# EAGLE design mother_card_cs_524pm (EAGLE 8.3.2)
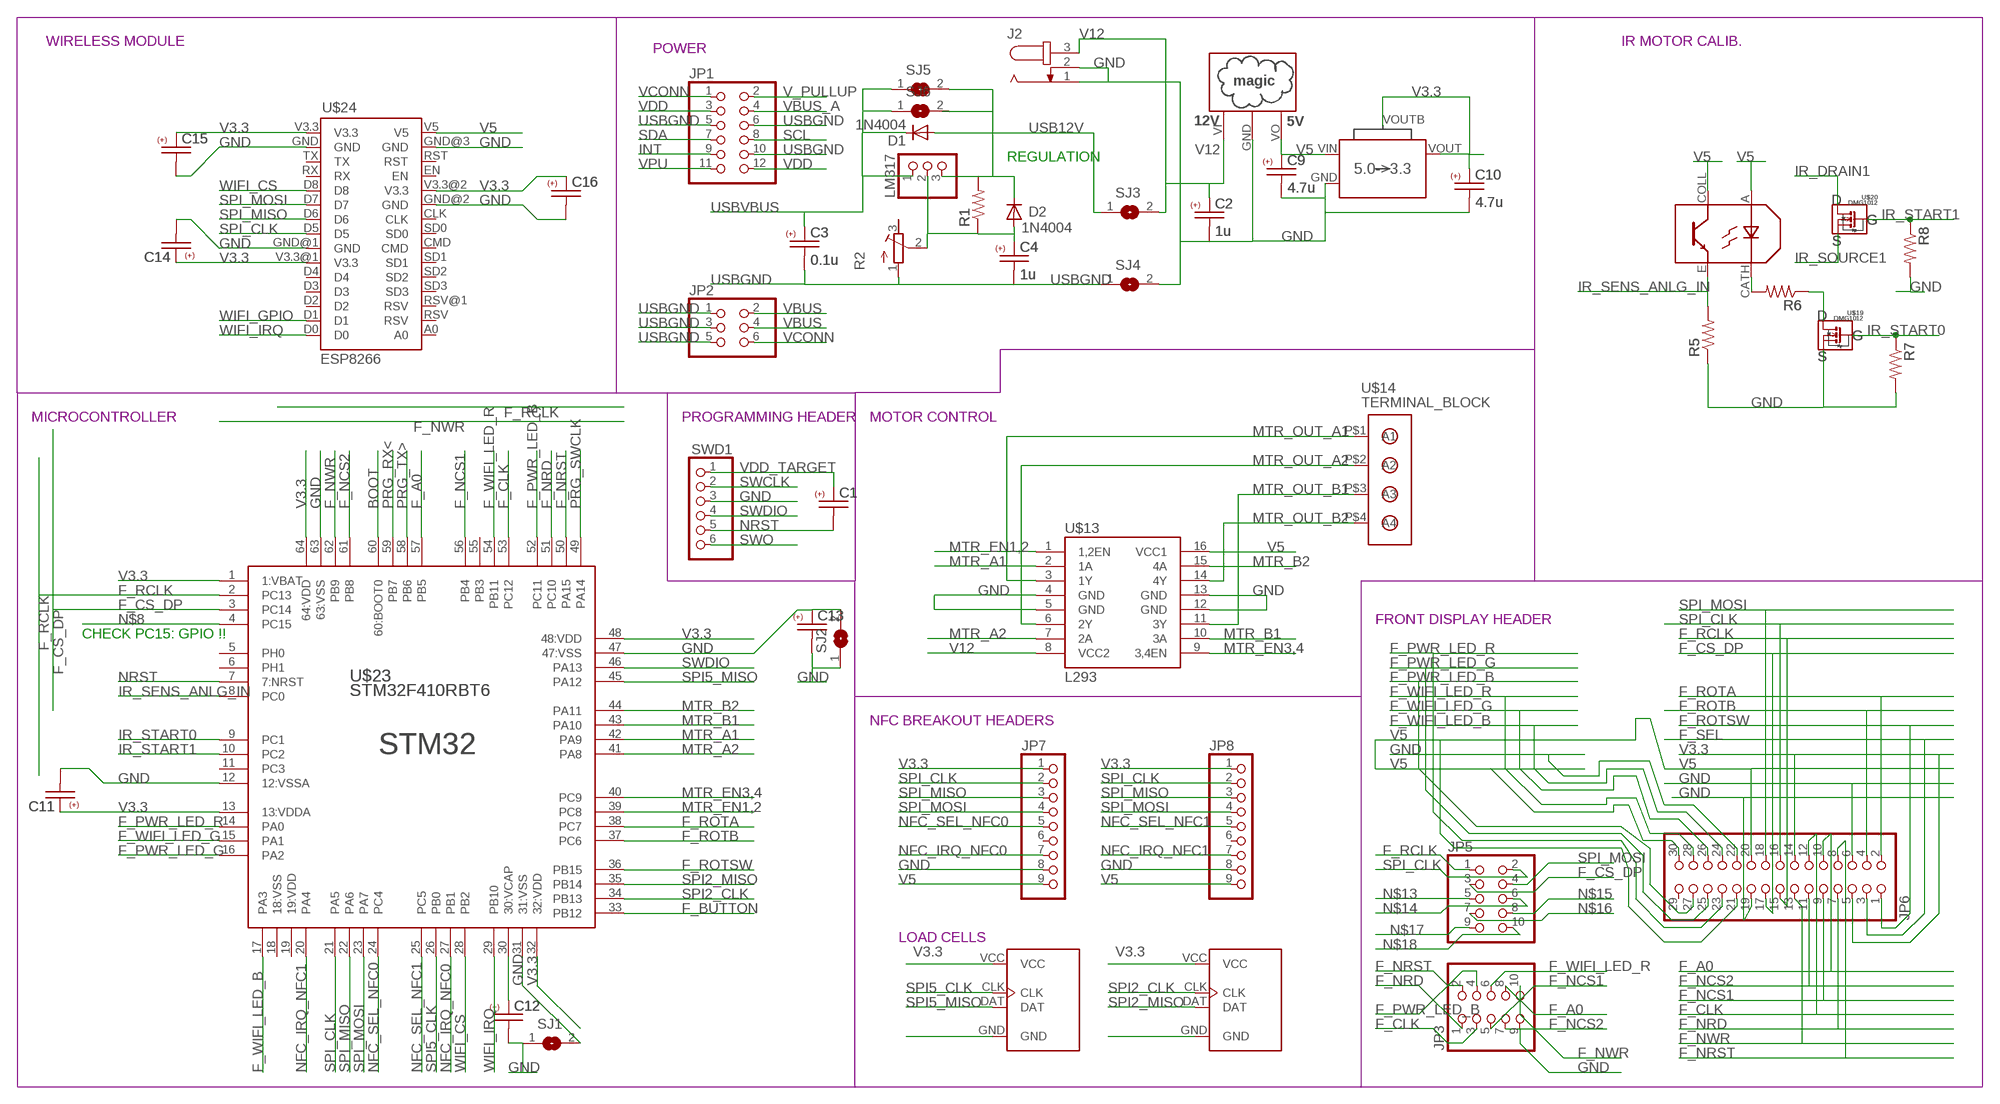
[diagram p0: schematic, sheet 1]

## Parts
C1  C-USC0805  [C0805]
C2  1u  C-USC0805  [C0805]
C3  0.1u  C-USC0805  [C0805]
C4  1u  C-USC0805  [C0805]
C9  4.7u  C-USC0805  [C0805]
C10  4.7u  C-USC0805  [C0805]
C11  C-USC0805  [C0805]
C12  C-USC0805  [C0805]
C13  C-USC0805  [C0805]
C14  C-USC0805  [C0805]
C15  C-USC0805  [C0805]
C16  C-USC0805  [C0805]
D1  1N4004  [DO41-10]
D2  1N4004  [DO41-10]
J2  JACK-PLUG0  [SPC4077]
JP1  PINHD-2X6  [2X06]
JP2  PINHD-2X3  [2X03]
JP3  PINHD-2X5  [2X05]
JP5  PINHD-2X5  [2X05]
JP6  PINHD-2X15/SOCK  [2X15/SOCK]
JP7  PINHD-1X9/90  [1X09/90]
JP8  PINHD-1X9/90  [1X09/90]
LM317  PINHD-1X3  [1X03]
R1  R-US_R0805  [R0805]
R2  R-TRIMM64W  [RTRIM64W]
R5  R-US_R0805  [R0805]
R6  R-US_R0805  [R0805]
R7  R-US_R0805  [R0805]
R8  R-US_R0805  [R0805]
SJ1  SJ  [SJ]
SJ2  SJ  [SJ]
SJ3  SJ  [SJ]
SJ4  SJ  [SJ]
SJ5  SJ  [SJ]
SJ6  SJ  [SJ]
SWD1  PINHD-1X6  [1X06]
U$13  L293  [DIL16]
U$14  TERMINAL_BLOCK  [1X4/BLOCK]
U$15  AP2114H  [AP2114H]
U$16  OKI-78SR-W36  [SIP3]
U$18  TCRT5000  [TCRT5000]
U$19  DMG1012  [SOT323]
U$20  DMG1012  [SOT323]
U$21  HX711  [HX711]
U$22  HX711  [HX711]
U$23  STM32F410RBT6  [QFP50P1200X1200X160-64N]
U$24  ESP8266  [ESP8266]

## Nets
BOOT: U$23.60(60:BOOT0)
F_A0: JP3.8 JP6.10 U$23.57(PB5)
F_BUTTON: U$23.33(PB12)
F_CLK: JP3.3 JP6.12 U$23.53(PC12)
F_CS_DP: JP5.3 JP6.17 U$23.3(PC14)
F_NCS1: JP3.5 JP6.9 U$23.56(PB4)
F_NCS2: JP3.7 JP6.11 U$23.61(PB8)
F_NRD: JP3.1 JP6.7 U$23.51(PC10)
F_NRST: JP3.2 JP6.8 U$23.50(PA15)
F_NWR: JP3.10 JP6.13 U$23.62(PB9)
F_PWR_LED_B: JP3.4 JP6.27 U$23.52(PC11)
F_PWR_LED_G: JP6.25 U$23.16(PA2)
F_PWR_LED_R: JP6.23 U$23.14(PA0)
F_RCLK: JP5.1 JP6.15 U$23.2(PC13)
F_ROTA: JP6.2 U$23.38(PC7)
F_ROTB: JP6.4 U$23.37(PC6)
F_ROTSW: JP6.1 U$23.36(PB15)
F_SEL: JP6.3
F_WIFI_LED_B: JP6.24 U$23.17(PA3)
F_WIFI_LED_G: JP6.26 U$23.15(PA1)
F_WIFI_LED_R: JP3.6 JP6.28 U$23.54(PB11)
GND: C2.2 C9.2 C10.2 C11.2 C12.2 C13.1 C14.2 C15.2 C16.2 J2.1 J2.2 JP3.9 JP6.6 JP6.19 JP6.22 JP7.8 JP8.8 R5.1 R7.2 R8.2 SJ1.1 SJ1.2 SJ2.2 SJ4.2 SWD1.3 U$13.4(GND) U$13.5(GND) U$13.12(GND) U$13.13(GND) U$15.GND U$16.GND U$19.S U$21.GND U$22.GND U$23.12(12:VSSA) U$23.31(31:VSS) U$23.47(47:VSS) U$23.63(63:VSS) U$24.GND U$24.GND@1(GND) U$24.GND@2(GND) U$24.GND@3(GND)
INT: JP1.9
IR_DRAIN1: U$20.D
IR_SENS_ANLG_IN: R5.2 U$18.E U$23.8(PC0)
IR_SOURCE1: U$20.S
IR_START0: R7.1 U$19.G U$23.9(PC1)
IR_START1: R8.1 U$20.G U$23.10(PC2)
MTR_A1: U$13.2(1A) U$23.42(PA9)
MTR_A2: U$13.7(2A) U$23.41(PA8)
MTR_B1: U$13.10(3A) U$23.43(PA10)
MTR_B2: U$13.15(4A) U$23.44(PA11)
MTR_EN1,2: U$13.1(1,2EN) U$23.39(PC8)
MTR_EN3,4: U$13.9(3,4EN) U$23.40(PC9)
MTR_OUT_A1: U$13.3(1Y) U$14.P$1(A1)
MTR_OUT_A2: U$13.6(2Y) U$14.P$2(A2)
MTR_OUT_B1: U$13.11(3Y) U$14.P$3(A3)
MTR_OUT_B2: U$13.14(4Y) U$14.P$4(A4)
N$1: C12.1 U$23.30(30:VCAP)
N$2: C13.2 SJ2.1
N$4: C4.1 D2.A LM317.2 R1.1 R2.2(S)
N$5: R6.2 U$18.CATH
N$8: U$23.4(PC15)
N$10: R6.1 U$19.D
N$13: JP5.5
N$14: JP5.6
N$15: JP5.8
N$16: JP5.7
N$17: JP5.9
N$18: JP5.10
NFC_IRQ_NFC0: JP7.7 U$23.27(PB1)
NFC_IRQ_NFC1: JP8.7 U$23.20(PA4)
NFC_SEL_NFC0: JP7.5 U$23.24(PC4)
NFC_SEL_NFC1: JP8.5 U$23.25(PC5)
NRST: C1.2 SWD1.5 U$23.7(7:NRST)
PRG_RX<: U$23.59(PB7)
PRG_SWCLK: U$23.49(PA14)
PRG_TX>: U$23.58(PB6)
SCL: JP1.8
SDA: JP1.7
SPI2_CLK: U$22.CLK U$23.34(PB13)
SPI2_MISO: U$22.DAT U$23.35(PB14)
SPI5_CLK: U$21.CLK U$23.26(PB0)
SPI5_MISO: U$21.DAT U$23.45(PA12)
SPI_CLK: JP5.2 JP6.16 JP7.2 JP8.2 U$23.21(PA5) U$24.D5
SPI_MISO: JP7.3 JP8.3 U$23.22(PA6) U$24.D6
SPI_MOSI: JP5.4 JP6.18 JP7.4 JP8.4 U$23.23(PA7) U$24.D7
SWCLK: SWD1.2
SWDIO: SWD1.4 U$23.46(PA13)
SWO: SWD1.6
USB12V: D1.A D2.C LM317.3 R1.2 SJ3.1 SJ5.2
USBGND: C3.2 C4.2 JP1.5 JP1.6 JP1.10 JP2.1 JP2.3 JP2.5 R2.1(A) SJ4.1
USBVBUS: C3.1 D1.C LM317.1 SJ5.1 SJ6.1
V3.3: C10.1 C11.1 C14.1 C15.1 C16.1 JP6.5 JP6.14 JP7.1 JP8.1 U$15.VOUT(VO) U$15.VOUTB(BODY) U$21.VCC U$22.VCC U$23.1(1:VBAT) U$23.13(13:VDDA) U$23.32(32:VDD) U$23.48(48:VDD) U$23.64(64:VDD) U$24.V3.3 U$24.V3.3@1(V3.3) U$24.V3.3@2(V3.3)
V5: C9.1 JP6.20 JP6.21 JP6.30 JP7.9 JP8.9 U$13.16(VCC1) U$15.VIN(VI) U$16.VO U$18.A U$18.COLL U$24.V5
V12: C2.1 J2.3 SJ3.2 U$13.8(VCC2) U$16.VI
V_PULLUP: JP1.2
VBUS: JP2.2 JP2.4
VBUS_A: JP1.4
VCONN: JP1.1 JP2.6
VDD: JP1.3 JP1.12
VDD_TARGET: C1.1 SWD1.1
VPU: JP1.11
WIFI_CS: U$23.28(PB2) U$24.D8
WIFI_GPIO: U$24.D1
WIFI_IRQ: U$23.29(PB10) U$24.D0
Unconnected: JP6.29 JP7.6 JP8.6 R2.3(E) SJ6.2 U$23.5(PH0) U$23.6(PH1) U$23.11(PC3) U$23.18(18:VSS) U$23.19(19:VDD) U$23.55(PB3) U$24.A0 U$24.CLK U$24.CMD U$24.D2 U$24.D3 U$24.D4 U$24.EN U$24.RST U$24.RSV U$24.RSV@1(RSV) U$24.RX U$24.SD0 U$24.SD1 U$24.SD2 U$24.SD3 U$24.TX

## Notes on the sheet
- WIRELESS MODULE | IR MOTOR CALIB.
- POWER
- REGULATION
- MICROCONTROLLER | PROGRAMMING HEADER | MOTOR CONTROL
- FRONT DISPLAY HEADER
- CHECK PC15: GPIO !!
- NFC BREAKOUT HEADERS
- LOAD CELLS

## Library data of the parts
C1-C4 C9-C16 = seniorDesign:C-US: CAPACITOR, American symbol
D1 D2 = diode:1N4004: DIODE general purpose rectifier, 1 A
J2 = con-jack:JACK-PLUG: DC POWER JACK Power Jack, DC, Right Angle, Through Hole, Rated 5A at 16VDC, PC Terminals Distributor: Farnell (www.Farnell.de) Drawing: 84N1161.pdf / 84N1162.pdf Manufacturer: SPC Technology (www.spctechnology.com) Type: SPC4077 / SPC 4078; OC_FARNELL: unknown; OC_NEWARK: unknown
JP1 = pinhead:PINHD-2X6: PIN HEADER
JP2 = pinhead:PINHD-2X3: PIN HEADER
JP3 JP5 = pinhead:PINHD-2X5: PIN HEADER
JP6 = csomers:PINHD-2X15: PIN HEADER, socket for parallel cable, IDC connector, On Shore Technology Inc.
JP7 JP8 = pinhead:PINHD-1X9: PIN HEADER
LM317 = pinhead:PINHD-1X3: PIN HEADER
R1 R5-R8 = seniorDesign:R-US_: RESISTOR, American symbol
R2 = rcl:R-TRIMM: Trimm resistor
SJ1-SJ6 = jumper:SJ: SMD solder JUMPER
SWD1 = pinhead:PINHD-1X6: PIN HEADER
U$13 = seniorDesign:L293: L293 Stepper Motor Driver
U$14 = seniorDesign:TERMINAL_BLOCK: Terminal Block for stepper motor connections
U$15 = seniorDesign:AP2114: AP2114H-3.3TRG1DICT-ND 5V LDO, main 5V line, motherboard https://www.diodes.com/assets/Datasheets/AP2114.pdf
U$16 = seniorDesign:OKI-78SR-W36
U$18 = seniorDesign:TCRT5000: Vishay Semiconductor Opto Division TCRT5000 mother board cover repositioning http://www.vishay.com/docs/83760/tcrt5000.pdf
U$19 U$20 = seniorDesign:DMG1012: DMG1012UW-7DICT-ND https://www.diodes.com/assets/Datasheets/ds31859.pdf Vt ~= 1.25V, IDS ~= 0.900 A, [VGS = (3.3 - 0.7)V, VDS = 0V]
U$21 U$22 = seniorDesign:HX711: old green circuit board rendition of HX711 load amplifier
U$23 = seniorDesign:STM32F410RBT6: STMicroelectronics STM32F410RBT6 main microcontroller, motherboard http://www.st.com/.../content/translations/en.DM00214043.pdf <http://www.st.com/content/ccc/resource/technical/document/datasheet/6e/f3/b0/1b/05/eb/49/fe/DM00214043.pdf/files/DM00214043.pdf/jcr:content/translations/en.DM00214043.pdf>
U$24 = seniorDesign:ESP8266: ESP8266 Wifi Module Breakout

## Board
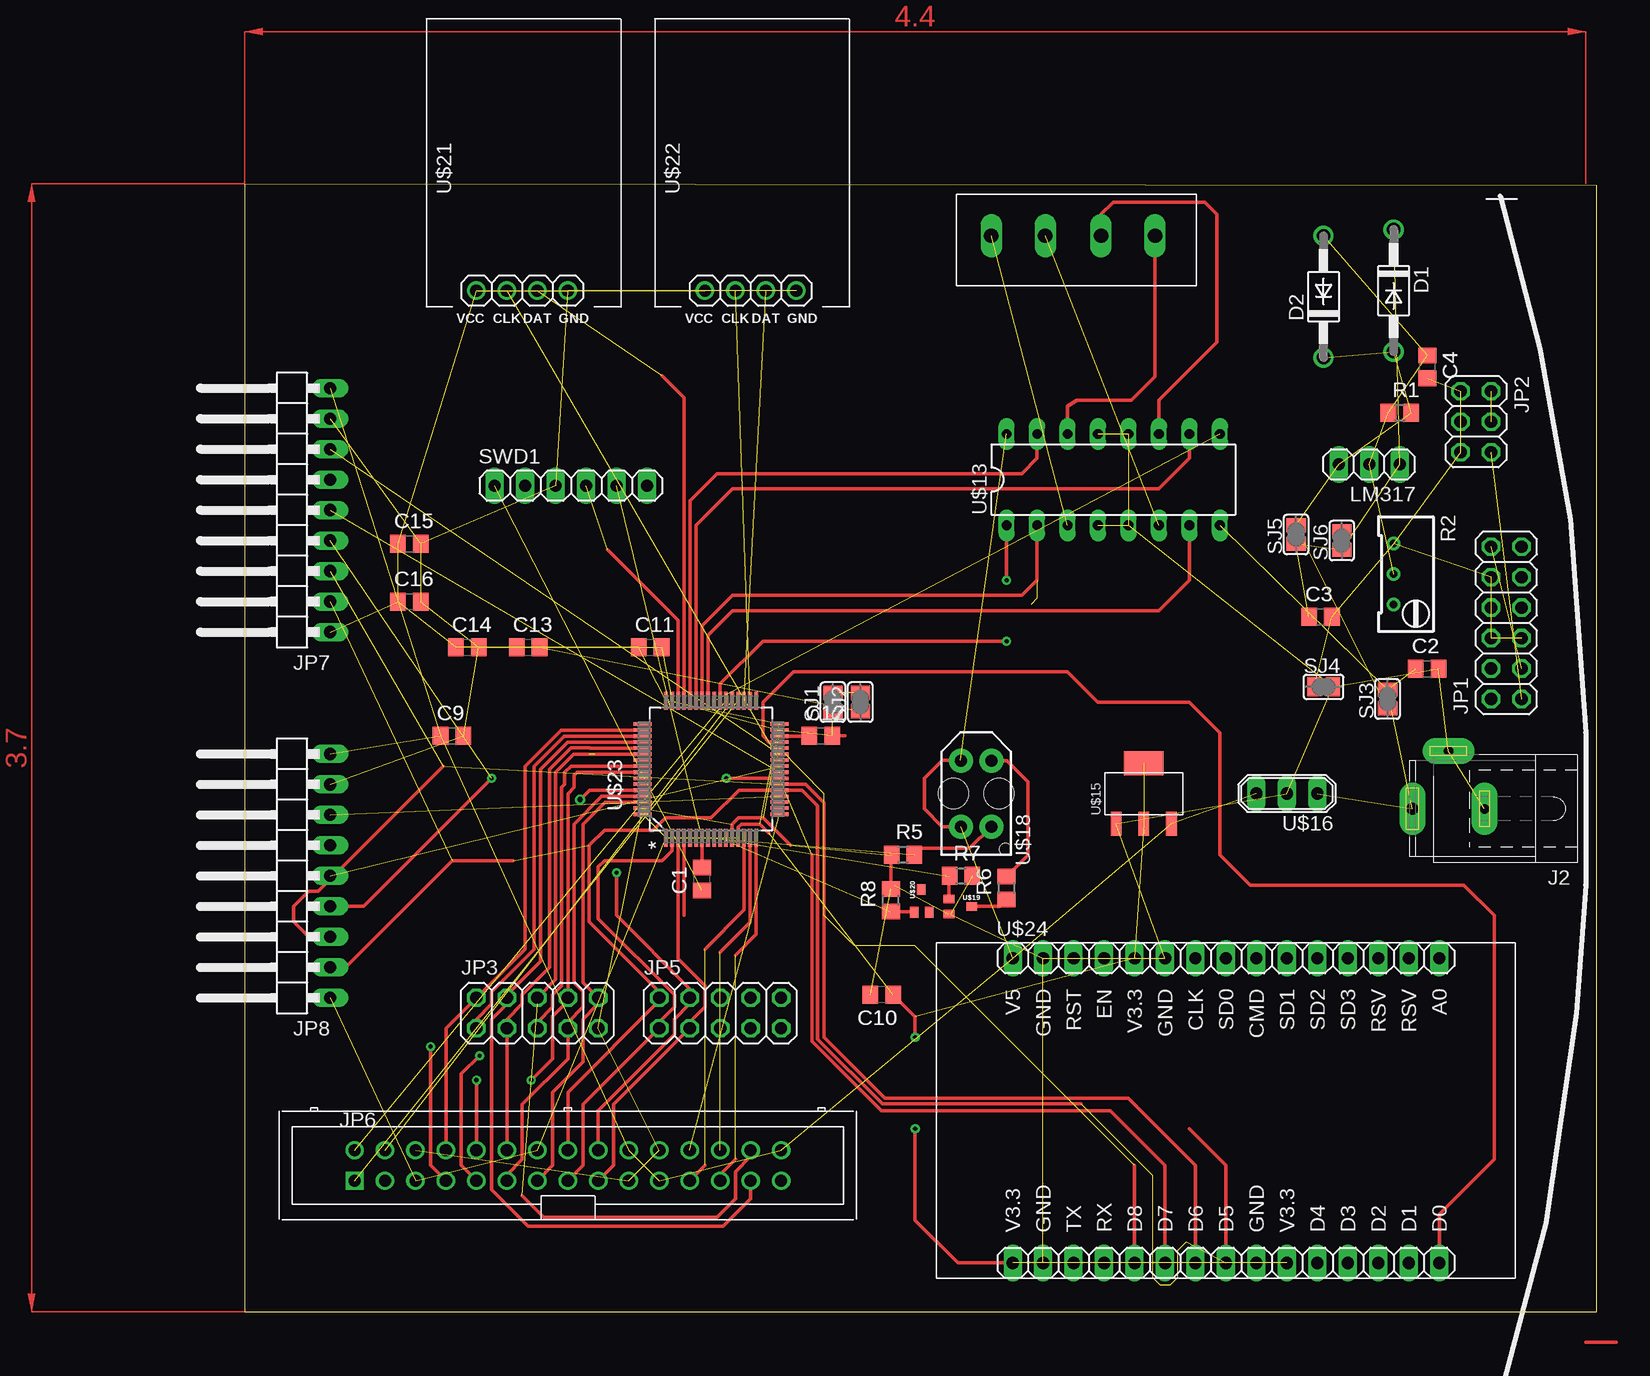
[diagram p1: board, top side]
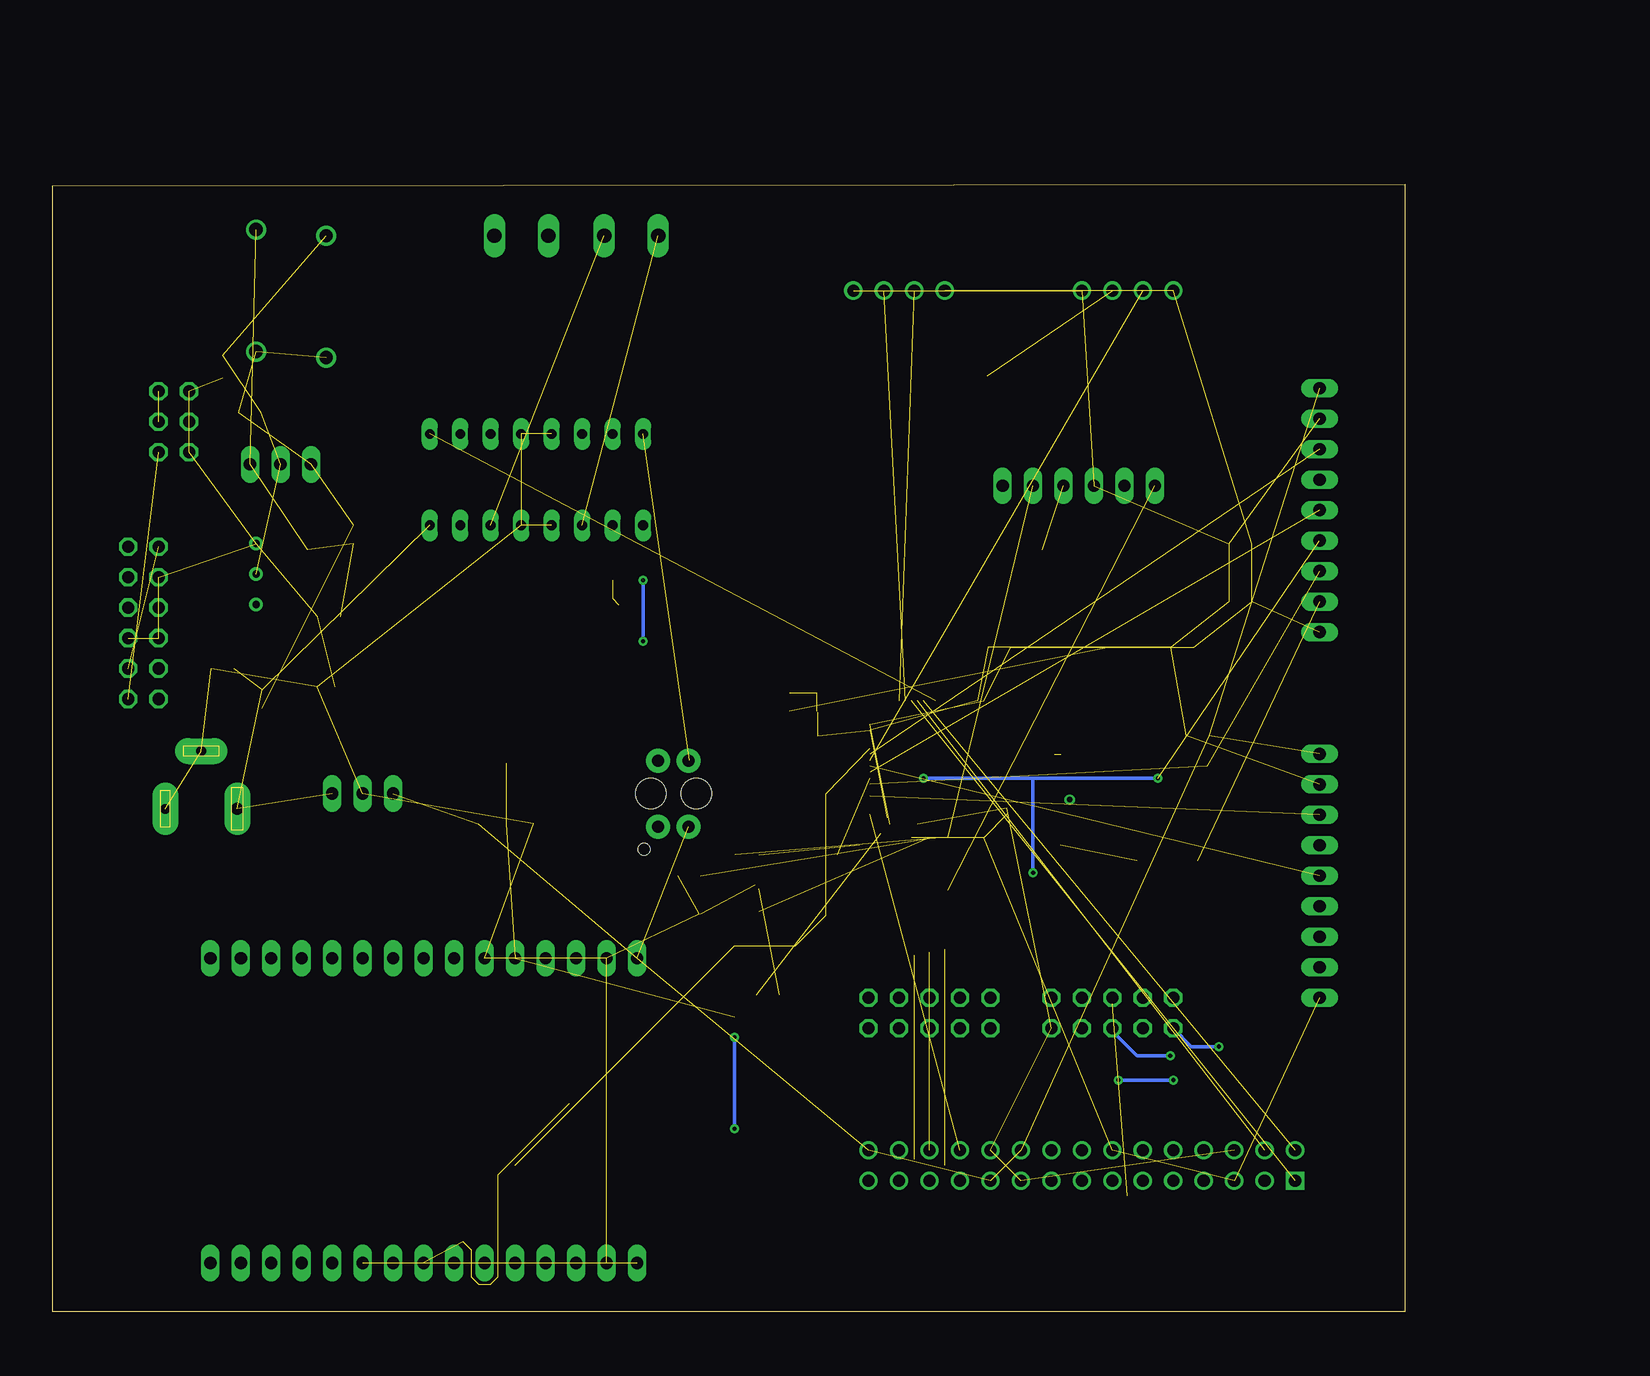
[diagram p2: board, bottom side, seen from below]

Size 112.7 x 93.97 mm. Coordinates in mm from the lower left corner, seen from the top.
Outline: 0,0 112.7,0 112.7,93.84 0,93.97 0,0
Copper layers (1*16): Top 0.035mm / dielectric 1.5mm / Bottom 0.035mm
Design rules "default": minimum track width 6mil, minimum drill 0.35mm, track to track 6mil, track to pad 6mil, pad to pad 6mil, via to via 6mil, smd to smd 6mil, copper to edge 40mil, drill to drill 6mil, minimum pad ring 10mil, minimum via ring 8mil, stop-mask expansion 4mil, vias tented up to drill 0mil, thermal gap 10mil

### Footprints (pad centres in the part's own frame; a part is rotated, then mirrored left to right if it is on the bottom)
C0805 = smd 1.3 x 1.5: 1 -0.95,0; 2 0.95,0
DO41-10 = drill 1.118: A 5.08,0; C -5.08,0
SPC4077 = drill 0.8 pad 2.184 long: 1 -3,0; 2 0,-4.8 | drill 1 pad 2.184 long: 3 3,0
2X06 = drill 1.016 octagon: 1 -6.35,-1.27; 2 -6.35,1.27; 3 -3.81,-1.27; 4 -3.81,1.27; 5 -1.27,-1.27; 6 -1.27,1.27; 7 1.27,-1.27; 8 1.27,1.27; 9 3.81,-1.27; 10 3.81,1.27; 11 6.35,-1.27; 12 6.35,1.27
2X03 = drill 1.016 octagon: 1 -2.54,-1.27; 2 -2.54,1.27; 3 0,-1.27; 4 0,1.27; 5 2.54,-1.27; 6 2.54,1.27
2X05 = drill 1.016 octagon: 1 -5.08,-1.27; 2 -5.08,1.27; 3 -2.54,-1.27; 4 -2.54,1.27; 5 0,-1.27; 6 0,1.27; 7 2.54,-1.27; 8 2.54,1.27; 9 5.08,-1.27; 10 5.08,1.27
2X15/SOCK = drill 1.016 square: 1 -17.78,-1.27 | drill 1.016: 2 -17.78,1.27; 3 -15.24,-1.27; 4 -15.24,1.27; 5 -12.7,-1.27; 6 -12.7,1.27; 7 -10.16,-1.27; 8 -10.16,1.27; 9 -7.62,-1.27; 10 -7.62,1.27; 11 -5.08,-1.27; 12 -5.08,1.27; 13 -2.54,-1.27; 14 -2.54,1.27; 15 0,-1.27; 16 0,1.27; 17 2.54,-1.27; 18 2.54,1.27; 19 5.08,-1.27; 20 5.08,1.27; 21 7.62,-1.27; 22 7.62,1.27; 23 10.16,-1.27; 24 10.16,1.27; 25 12.7,-1.27; 26 12.7,1.27; 27 15.24,-1.27; 28 15.24,1.27; 29 17.78,-1.27; 30 17.78,1.27
1X09/90 = drill 1.016 long: 1 -10.16,-3.81; 2 -7.62,-3.81; 3 -5.08,-3.81; 4 -2.54,-3.81; 5 0,-3.81; 6 2.54,-3.81; 7 5.08,-3.81; 8 7.62,-3.81; 9 10.16,-3.81
1X03 = drill 1.016 long: 1 -2.54,0; 2 0,0; 3 2.54,0
R0805 = smd 1.3 x 1.5: 1 -0.95,0; 2 0.95,0
RTRIM64W = drill 0.61: 1 1.27,-2.54; 2 1.27,0; 3 1.27,2.54
SJ = smd 1.168 x 1.6: 1 -0.762,0; 2 0.762,0
1X06 = drill 1.016 long: 1 -6.35,0; 2 -3.81,0; 3 -1.27,0; 4 1.27,0; 5 3.81,0; 6 6.35,0
DIL16 = drill 0.813 long: 1 -8.89,-3.81; 2 -6.35,-3.81; 3 -3.81,-3.81; 4 -1.27,-3.81; 5 1.27,-3.81; 6 3.81,-3.81; 7 6.35,-3.81; 8 8.89,-3.81; 9 8.89,3.81; 10 6.35,3.81; 11 3.81,3.81; 12 1.27,3.81; 13 -1.27,3.81; 14 -3.81,3.81; 15 -6.35,3.81; 16 -8.89,3.81
1X4/BLOCK = drill 1.2 long: P$1 0,0; P$2 4.5,0; P$3 9.15,0; P$4 13.65,0
AP2114H = smd 0.9 x 2: GND -2.3,-2.52; VIN 2.3,-2.52; VOUT 0,-2.52 | smd 3.3 x 2: VOUTB 0,2.53
SIP3 = drill 1.016 long: GND 0,0; VI -2.54,0; VO 2.54,0
TCRT5000 = drill 1 pad 2: A 2.75,1.27; CATH 2.75,-1.27; COLL -2.75,1.27; E -2.75,-1.27 | hole 2.5: 0,1.9; 0,-1.9 | hole 1: -4.65,-2.45
SOT323 = smd 0.7 x 0.9: D 0,0.9; G -0.6,-1; S 0.65,-1
HX711 = drill 1.016: CLK -2.54,1.52; DAT -2.54,4.06; GND -2.54,6.6; VCC -2.54,-1.02
QFP50P1200X1200X160-64N = smd 1.5 x 0.3: 1 -5.715,3.759; 2 -5.715,3.251; 3 -5.715,2.743; 4 -5.715,2.261; 5 -5.715,1.753; 6 -5.715,1.245; 7 -5.715,0.762; 8 -5.715,0.254; 9 -5.715,-0.254; 10 -5.715,-0.762; 11 -5.715,-1.245; 12 -5.715,-1.753; 13 -5.715,-2.261; 14 -5.715,-2.743; 15 -5.715,-3.251; 16 -5.715,-3.759; 33 5.715,-3.759; 34 5.715,-3.251; 35 5.715,-2.743; 36 5.715,-2.261; 37 5.715,-1.753; 38 5.715,-1.245; 39 5.715,-0.762; 40 5.715,-0.254; 41 5.715,0.254; 42 5.715,0.762; 43 5.715,1.245; 44 5.715,1.753; 45 5.715,2.261; 46 5.715,2.743; 47 5.715,3.251; 48 5.715,3.759 | smd 0.3 x 1.5: 17 -3.759,-5.715; 18 -3.251,-5.715; 19 -2.743,-5.715; 20 -2.261,-5.715; 21 -1.753,-5.715; 22 -1.245,-5.715; 23 -0.762,-5.715; 24 -0.254,-5.715; 25 0.254,-5.715; 26 0.762,-5.715; 27 1.245,-5.715; 28 1.753,-5.715; 29 2.261,-5.715; 30 2.743,-5.715; 31 3.251,-5.715; 32 3.759,-5.715; 49 3.759,5.715; 50 3.251,5.715; 51 2.743,5.715; 52 2.261,5.715; 53 1.753,5.715; 54 1.245,5.715; 55 0.762,5.715; 56 0.254,5.715; 57 -0.254,5.715; 58 -0.762,5.715; 59 -1.245,5.715; 60 -1.753,5.715; 61 -2.261,5.715; 62 -2.743,5.715; 63 -3.251,5.715; 64 -3.759,5.715
ESP8266 = drill 1.016 long: A0 19.05,0; CLK -1.27,0; CMD 3.81,0; D0 19.05,-25.4; D1 16.51,-25.4; D2 13.97,-25.4; D3 11.43,-25.4; D4 8.89,-25.4; D5 1.27,-25.4; D6 -1.27,-25.4; D7 -3.81,-25.4; D8 -6.35,-25.4; EN -8.89,0; GND -13.97,-25.4; GND@1 3.81,-25.4; GND@2 -3.81,0; GND@3 -13.97,0; RST -11.43,0; RSV 16.51,0; RSV@1 13.97,0; RX -8.89,-25.4; SD0 1.27,0; SD1 6.35,0; SD2 8.89,0; SD3 11.43,0; TX -11.43,-25.4; V3.3 -16.51,-25.4; V3.3@1 6.35,-25.4; V3.3@2 -6.35,0; V5 -16.51,0

### Placement (x,y rotation side)
C1  38.1,36.07 90 top
C2  98.55,53.59 0 top
C3  89.66,57.91 0 top
C4  98.55,78.74 270 top
C9  17.27,48.01 0 top
C10  53.09,26.42 180 top
C11  33.78,55.37 0 top
C12  48.01,48.01 0 top
C13  23.62,55.37 0 top
C14  18.54,55.37 0 top
C15  13.72,64.01 0 top
C16  13.72,59.18 0 top
D1  95.76,85.09 270 top
D2  89.92,84.58 90 top
J2  100.33,41.91 180 top
JP1  105.16,57.4 90 top
JP2  102.62,74.17 270 top
JP3  24.38,24.89 0 top
JP5  39.62,24.89 0 top
JP6  26.92,12.19 0 top
JP7  3.3,66.8 90 top
JP8  3.3,36.32 90 top
LM317  93.73,70.61 180 top
R1  96.27,74.93 0 top
R2  97.03,61.47 180 top
R5  54.86,38.1 0 top
R6  63.5,35.31 90 top
R7  59.69,36.32 0 top
R8  53.85,34.29 90 top
SJ1  49.02,50.8 90 top
SJ2  51.31,50.8 90 top
SJ3  95.25,51.05 90 top
SJ4  89.92,52.07 0 top
SJ5  87.63,64.77 90 top
SJ6  91.44,64.26 90 top
SWD1  27.18,68.83 0 top
U$13  72.39,69.34 0 top
U$14  62.23,89.66 0 top
U$15  74.93,43.18 0 top
U$16  86.87,43.18 180 top
U$18  60.96,43.18 90 top
U$19  59.69,33.78 270 top
U$20  56.39,34.29 0 top
U$21  20.32,82.55 270 top
U$22  39.37,82.55 270 top
U$23  38.86,45.21 90 top
U$24  80.52,29.46 0 top

### Tracks (layer width: path | path; a pad name or v marks a point on that pad's centre or on a via)
BOOT  (via drill 0.45)
  Top 0.305: U$23.60 28.73,43.46 v27.94,42.67
F_A0  (via drill 0.35)
  Top 0.305: v23.88,19.3 25.65,21.08 25.65,24.64 26.92,25.91 JP3.8 26.92,43.18 27.43,43.69 27.43,44.7 27.69,44.96 U$23.57 | v19.3,19.3 JP6.10
  Bottom 0.305: v23.88,19.3 v19.3,19.3
F_CLK
  Top 0.305: U$23.53 28.76,46.97 28.73,46.99 27.18,46.99 25.4,45.21 25.4,28.7 23.11,26.42 23.11,25.65 21.84,24.38 JP3.3 JP6.12
F_CS_DP
  Top 0.305: JP6.17 30.73,12.19 30.73,17.27 JP5.3 37.08,24.13 38.35,25.4 38.35,27.18 36.12,29.41 U$23.3
F_NCS1  (via drill 0.35)
  Top 0.305: JP6.9 18.03,12.19 18.03,19.81 v19.56,21.34 | U$23.56 27.18,45.47 26.67,44.96 26.67,43.94 26.42,43.69 26.42,27.18 25.65,26.42 25.65,25.4 24.38,24.13 JP3.5
  Bottom 0.305: JP3.5 24.38,23.37 22.35,21.34 v19.56,21.34
F_NCS2
  Top 0.305: U$23.61 29.74,42.95 27.43,40.64 27.43,27.43 28.19,26.67 28.19,25.4 26.92,24.13 JP3.7 26.92,21.08 23.11,17.27 23.11,12.7 21.84,11.43 JP6.11
F_NRD  (via drill 0.35)
  Top 0.305: U$23.51 26.62,47.96 24.13,45.47 24.13,30.23 20.57,26.67 20.57,25.65 19.3,24.38 JP3.1 | v15.49,22.1 15.49,12.19 JP6.7
  Bottom 0.305: JP3.1 17.78,22.1 v15.49,22.1
F_NRST
  Top 0.305: U$23.50 26.36,48.46 23.37,45.47 23.37,30.73 23.37,30.7 23.37,30.23 JP3.2 16.76,23.62 JP6.8
F_NWR
  Top 0.305: U$23.62 30.02,42.47 28.19,40.64 28.19,27.43 29.34,26.29 | 29.34,26.29 JP3.10 | JP6.13 25.65,12.19 25.65,18.29 28.19,20.83 28.19,24.38 29.34,25.53 29.34,26.29
F_PWR_LED_B
  Top 0.305: JP6.27 42.16,9.4 39.88,7.11 23.62,7.11 20.57,10.16 20.57,24.38 21.84,25.65 JP3.4 21.84,26.42 24.64,29.21 24.64,45.21 26.9,47.47 U$23.52
F_PWR_LED_G  (1 unrouted)
  Top 0.305: JP6.25 39.62,11.43 40.89,12.7 | U$23.16 42.62,31.44 40.89,29.72
F_PWR_LED_R  (1 unrouted)
  Top 0.305: U$23.14 41.61,33.48 38.35,30.23 | 38.35,12.19 JP6.23
F_RCLK
  Top 0.305: U$23.2 35.61,38.41 34.8,37.59 29.97,37.59 29.46,37.08 29.46,32.77 35.81,26.42 35.81,25.4 34.54,24.13 JP5.1 28.19,17.27 28.19,12.19 JP6.15
F_ROTA  (1 unrouted)
F_ROTB  (1 unrouted)
F_ROTSW  (1 unrouted)
F_WIFI_LED_B  (1 unrouted)
F_WIFI_LED_G  (1 unrouted)
  Top 0.305: U$23.15 42.11,32.46 39.62,29.97
F_WIFI_LED_R  (2 unrouted)
  Top 0.305: 28.68,46.46 U$23.54 | JP6.28 42.16,12.95 40.89,11.68 40.89,9.4 39.37,7.87 24.89,7.87 23.11,9.65 | 29.21,46.46 27.41,46.46 25.91,44.96 25.91,27.69 JP3.6 24.38,25.65
GND  (40 unrouted)
  Top 0.305: R8.2 53.85,38.03 R5.1 | U$19.S 58.82,33.13 | U$23.12 40.62,40.62 41.15,41.15 43.18,41.15 45.47,38.86 | 48.96,49.97 SJ1.1 | 50.04,48.01 C12.2
  Top 0.406: R8.2 54.17,35.56
IR_SENS_ANLG_IN  (1 unrouted)
  Top 0.305: R5.2 56.32,38.42 56.13,38.61 60.41,38.61 U$18.E
IR_START0  (1 unrouted)
  Top 0.305: U$19.G 58.69,36.27 R7.1
IR_START1  (1 unrouted)
  Top 0.305: R8.1 55.74,33.34 U$20.G
  Top 0.406: 53.9,33.29 R8.1
MTR_A1  (2 unrouted)
  Top 0.305: U$13.2 66.04,60.96 64.77,59.69 40.64,59.69 38.1,57.15 U$23.42
MTR_A2
  Top 0.305: U$13.7 78.74,60.96 76.2,58.42 40.64,58.42 38.61,56.39 U$23.41
MTR_B1
  Top 0.305: U$13.10 78.74,71.12 76.2,68.58 40.64,68.58 37.59,65.53 37.59,50.95 U$23.43
MTR_B2
  Top 0.305: U$13.15 66.04,71.12 64.77,69.85 39.37,69.85 37.11,67.59 U$23.44
MTR_EN1,2  (via drill 0.35)
  Top 0.305: U$23.39 39.62,52.32 43.18,55.88 v63.5,55.88 | U$13.1 v63.5,60.96
  Bottom 0.305: v63.5,60.96 v63.5,55.88
MTR_EN3,4  (1 unrouted)
MTR_OUT_A1  (1 unrouted)
MTR_OUT_A2  (1 unrouted)
MTR_OUT_B1
  Top 0.305: U$14.P$3 71.38,91.45 72.39,92.46 80.01,92.46 81.03,91.44 81.03,80.77 76.2,75.95 U$13.11
MTR_OUT_B2
  Top 0.305: U$14.P$4 75.88,77.91 73.91,75.95 69.34,75.95 68.58,75.44 U$13.14
N$1
  Top 0.305: U$23.30 47,47.96 C12.1
N$2  (1 unrouted)
N$3
  Top 0.305: 111.76,-2.54 114.3,-2.54
N$4  (4 unrouted)
N$5
  Top 0.305: U$18.CATH 63.53,45.93 65.28,44.18 65.28,38.03 R6.2
N$6  (1 unrouted)
N$8
  Top 0.305: U$23.4 36.6,33.05
N$10
  Top 0.305: U$19.D 62.93,33.78 R6.1
NFC_IRQ_NFC0  (1 unrouted)
NFC_IRQ_NFC1  (1 unrouted)
NFC_SEL_NFC0  (1 unrouted)
NFC_SEL_NFC1  (1 unrouted)
NRST  (1 unrouted)
  Top 0.305: U$23.7 C1.2
SPI2_CLK  (1 unrouted)
SPI2_MISO  (1 unrouted)
SPI5_CLK  (1 unrouted)
SPI5_MISO  (1 unrouted)
  Top 0.305: U$23.45 36.6,76.17 34.8,77.98
SPI_CLK  (10 unrouted)
  Top 0.305: JP8.2 8.38,28.7 17.27,37.59 22.35,37.59 | JP6.16 26.92,18.29 34.54,25.91 JP5.2 34.54,26.67 28.7,32.51 28.7,38.86 29.97,40.13 34.04,40.13 35.05,41.15 38.86,41.15 41.17,43.46 U$23.21 46.46,43.46 47.75,42.16 47.75,22.72 53.15,17.32 69.68,17.32 | U$24.D5 81.79,12.19 78.74,15.24
SPI_MISO  (2 unrouted)
  Top 0.305: JP8.3 5.33,31.24 4.06,32.51 4.06,33.78 5.33,35.05 6.1,35.05 16.51,45.47 | U$24.D6 79.25,12.19 73.66,17.78 53.34,17.78 48.26,22.86 48.26,42.42 46.74,43.94 44.6,43.94 U$23.22
SPI_MOSI  (via drill 0.35)  (2 unrouted)
  Top 0.305: JP8.4 9.91,33.78 v20.57,44.45 | U$23.23 v40.13,44.45 | JP6.18 29.46,16.76 35.81,23.11 35.81,24.38 37.08,25.65 JP5.4 37.08,26.92 30.99,33.02 v30.99,36.58 | U$24.D7 76.71,12.19 72.14,16.76 53.06,16.76 47.3,22.53 47.3,38.1
  Bottom 0.305: v40.13,44.45 30.99,44.45 | 30.99,44.45 v20.57,44.45 | 30.99,44.45 v30.99,36.58
SWDIO  (1 unrouted)
  Top 0.305: U$23.46 36.12,57.61 30.23,63.5
USB12V  (5 unrouted)
USBGND  (9 unrouted)
USBVBUS  (4 unrouted)
V3.3  (via drill 0.35)  (19 unrouted)
  Top 0.305: U$23.13 41.12,40.36 41.4,40.64 42.93,40.64 43.69,39.88 | U$24.V3.3 59.44,4.06 55.88,7.62 v55.88,15.24 | v55.88,22.86 55.88,24.57 C10.1
  Bottom 0.305: v55.88,15.24 v55.88,22.86
V5  (10 unrouted)
  Top 0.305: U$18.COLL 58.12,40.43 56.64,41.91 56.64,42.18 | 56.64,42.18 | 56.64,42.18 56.64,44.45 58.17,45.97 59.65,45.97 U$18.A
V12  (4 unrouted)
VBUS  (1 unrouted)
VCONN  (1 unrouted)
VDD  (1 unrouted)
VDD_TARGET  (1 unrouted)
WIFI_CS  (5 unrouted)
  Top 0.305: U$24.D8 74.17,12.19
WIFI_IRQ
  Top 0.305: 44.55,47.5 U$23.29 43.71,47.47 43.18,48.01 43.18,50.8 45.72,53.34 68.58,53.34 71.12,50.8 78.74,50.8 81.28,48.26 81.28,38.1 83.82,35.56 101.6,35.56 104.14,33.02 104.14,12.7 99.57,8.13 U$24.D0
(copper drawn outside any net)
  shapes: Top area x2